# EAGLE design CAN_node_analog (EAGLE 8.0.1)
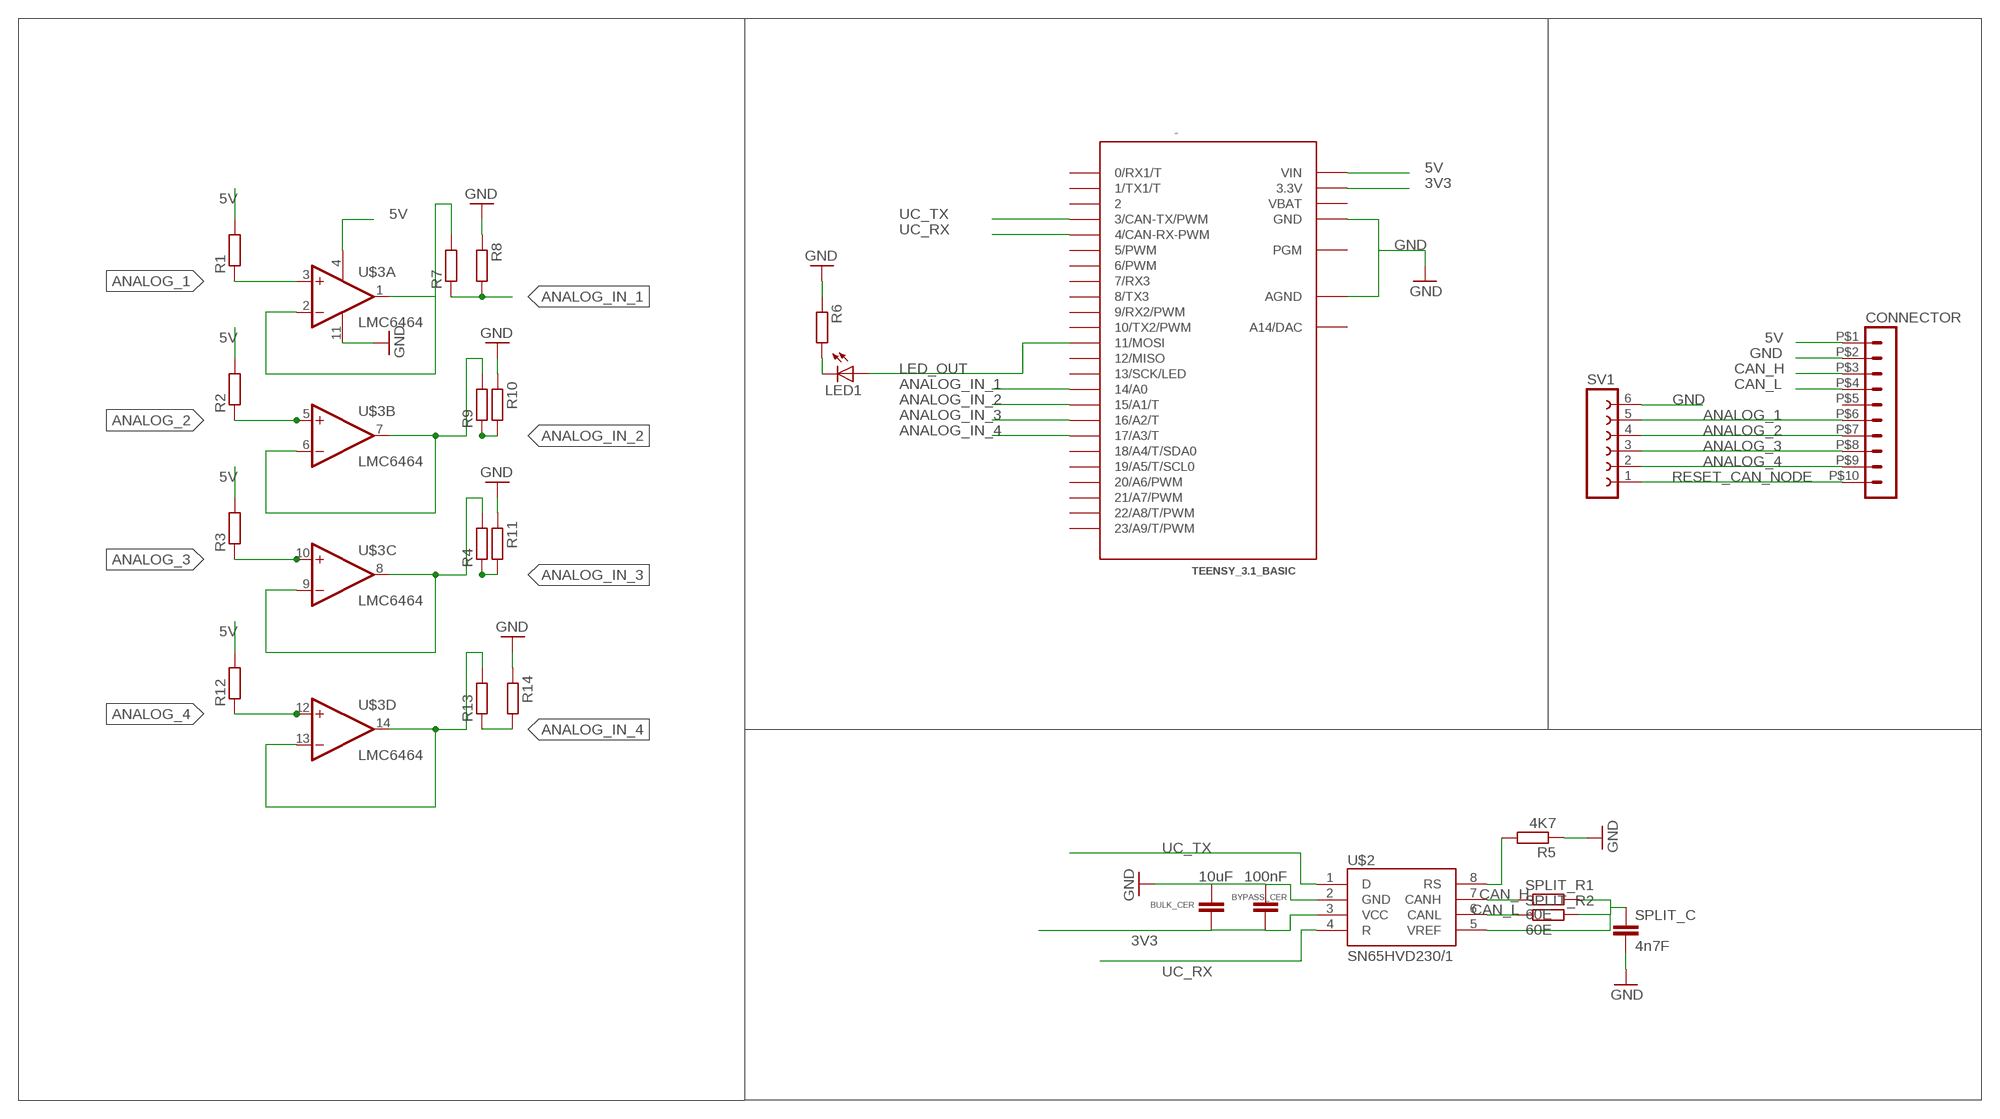
[diagram p0: schematic, sheet 1]

## Parts
BULK_CER  10uF  C-EUC0805  [C0805]
BYPASS_CER  100nF  C-EUC0805  [C0805]
CONNECTOR  HEADER_POS10_43045-1012  [43045-1012]
LED1  LED1206  [LED-1206]
R1  R-EU_R0805  [R0805]
R2  R-EU_R0805  [R0805]
R3  R-EU_R0805  [R0805]
R4  R-EU_R0805  [R0805]
R5  4K7  R-EU_R0805  [R0805]
R6  R-EU_R0805  [R0805]
R7  R-EU_R0805  [R0805]
R8  R-EU_R0805  [R0805]
R9  R-EU_R0805  [R0805]
R10  R-EU_R0805  [R0805]
R11  R-EU_R0805  [R0805]
R12  R-EU_R0805  [R0805]
R13  R-EU_R0805  [R0805]
R14  R-EU_R0805  [R0805]
SPLIT_C  4n7F  C-EUC0805  [C0805]
SPLIT_R1  60E  R-EU_R0805  [R0805]
SPLIT_R2  60E  R-EU_R0805  [R0805]
SV1  FE06-1  [FE06]
U$1  TEENSY_3.1_BASIC  [TEENSY_3.1_BASIC]
U$2  SN65HVD230/1  [SO8]
U$3  LMC6464  [SO14_LONGPADS]

## Nets
3V3: BULK_CER.1 BYPASS_CER.1 U$1.3.3V U$1.3.3V1(3.3V) U$2.3(VCC)
5V: CONNECTOR.P$1 R1.2 R2.2 R3.2 R12.2 U$1.VIN U$3.4(POW:V+)
.: R7.2 U$3.1(A:OUT) U$3.2(A:-IN)
.2: R9.2 U$3.6(B:-IN) U$3.7(B:OUT)
.3: R4.2 U$3.8(C:OUT) U$3.9(C:-IN)
.4: R13.2 U$3.13(D:-IN) U$3.14(D:OUT)
ANALOG_1: CONNECTOR.P$6 R1.1 SV1.5 U$3.3(A:+IN)
ANALOG_2: CONNECTOR.P$7 R2.1 SV1.4 U$3.5(B:+IN)
ANALOG_3: CONNECTOR.P$8 R3.1 SV1.3 U$3.10(C:+IN)
ANALOG_4: CONNECTOR.P$9 R12.1 SV1.2 U$3.12(D:+IN)
ANALOG_IN_1: R7.1 R8.2 U$1.14/A0
ANALOG_IN_2: R9.1 R10.2 U$1.15/A1(15/A1/T)
ANALOG_IN_3: R4.1 R11.2 U$1.16/A2(16/A2/T)
ANALOG_IN_4: R13.1 R14.2 U$1.17/A3(17/A3/T)
CAN_H: CONNECTOR.P$3 SPLIT_R1.1 U$2.7(CANH)
CAN_L: CONNECTOR.P$4 SPLIT_R2.1 U$2.6(CANL)
GND: BULK_CER.2 BYPASS_CER.2 CONNECTOR.P$2 R5.1 R6.1 R8.1 R10.1 R11.1 R14.1 SPLIT_C.2 SV1.6 U$1.AGND U$1.GND U$1.GND1(GND) U$2.2(GND) U$3.11(POW:V-)
LED_OUT: LED1.A U$1.11(11/MOSI)
N$1: LED1.C R6.2
N$5: R5.2 U$2.8(RS)
N$9: SPLIT_C.1 SPLIT_R1.2 SPLIT_R2.2 U$2.5(VREF)
RESET_CAN_NODE: CONNECTOR.P$10 SV1.1
UC_RX: U$1.4(4/CAN-RX-PWM) U$2.4(R)
UC_TX: U$1.3(3/CAN-TX/PWM) U$2.1(D)
Unconnected: CONNECTOR.P$5 U$1.0(0/RX1/T) U$1.1(1/TX1/T) U$1.2 U$1.5(5/PWM) U$1.6(6/PWM) U$1.7(7/RX3) U$1.8(8/TX3) U$1.9(9/RX2/PWM) U$1.10(10/TX2/PWM) U$1.12(12/MISO) U$1.13(13/SCK/LED) U$1.18/A4(18/A4/T/SDA0) U$1.19/A5(19/A5/T/SCL0) U$1.20/A6(20/A6/PWM) U$1.21/A7(21/A7/PWM) U$1.22/A8(22/A8/T/PWM) U$1.23/A9(23/A9/T/PWM) U$1.A14(A14/DAC) U$1.PGM

## Power pins joined to a net without a drawn wire
VBAT: U$1.VBAT

## Library data of the parts
BULK_CER BYPASS_CER SPLIT_C = LV:C-EU: CAPACITOR, European symbol
CONNECTOR = con-molex-micro-fit-3_0:HEADER_POS10_?: Molex - Micro-Fit 3.0 Series connector, 3.00mm (0.118") pitch header, 10 positions.
LED1 = IIT_BOMBAY_Racing:LED: LEDs Standard schematic elements and footprints for 5mm, 3mm, 1206, and 0603 sized LEDs. 5mm - Spark Fun Electronics SKU : COM-00529 (and others)
R1-R4 R6-R14 = IIT_BOMBAY_Racing:R-EU_: RESISTOR, European symbol
R5 SPLIT_R1 SPLIT_R2 = LV:R-EU_: RESISTOR, European symbol
SV1 = con-lsta:FE06-1: FEMALE HEADER; OC_FARNELL: unknown; OC_NEWARK: unknown
U$1 = IIT_BOMBAY_Racing:TEENSY_3.1_BASIC: Footprint for Teensy 3.1 board using all pin connections on the outer perimeter
U$2 = texas_1:SN65HVD230/1
U$3 = IIT_BOMBAY_Racing:LMC6464

## Net classes
0 default: width 0.127 mm, drill 0.127 mm, clearance 0.127 mm

## Board
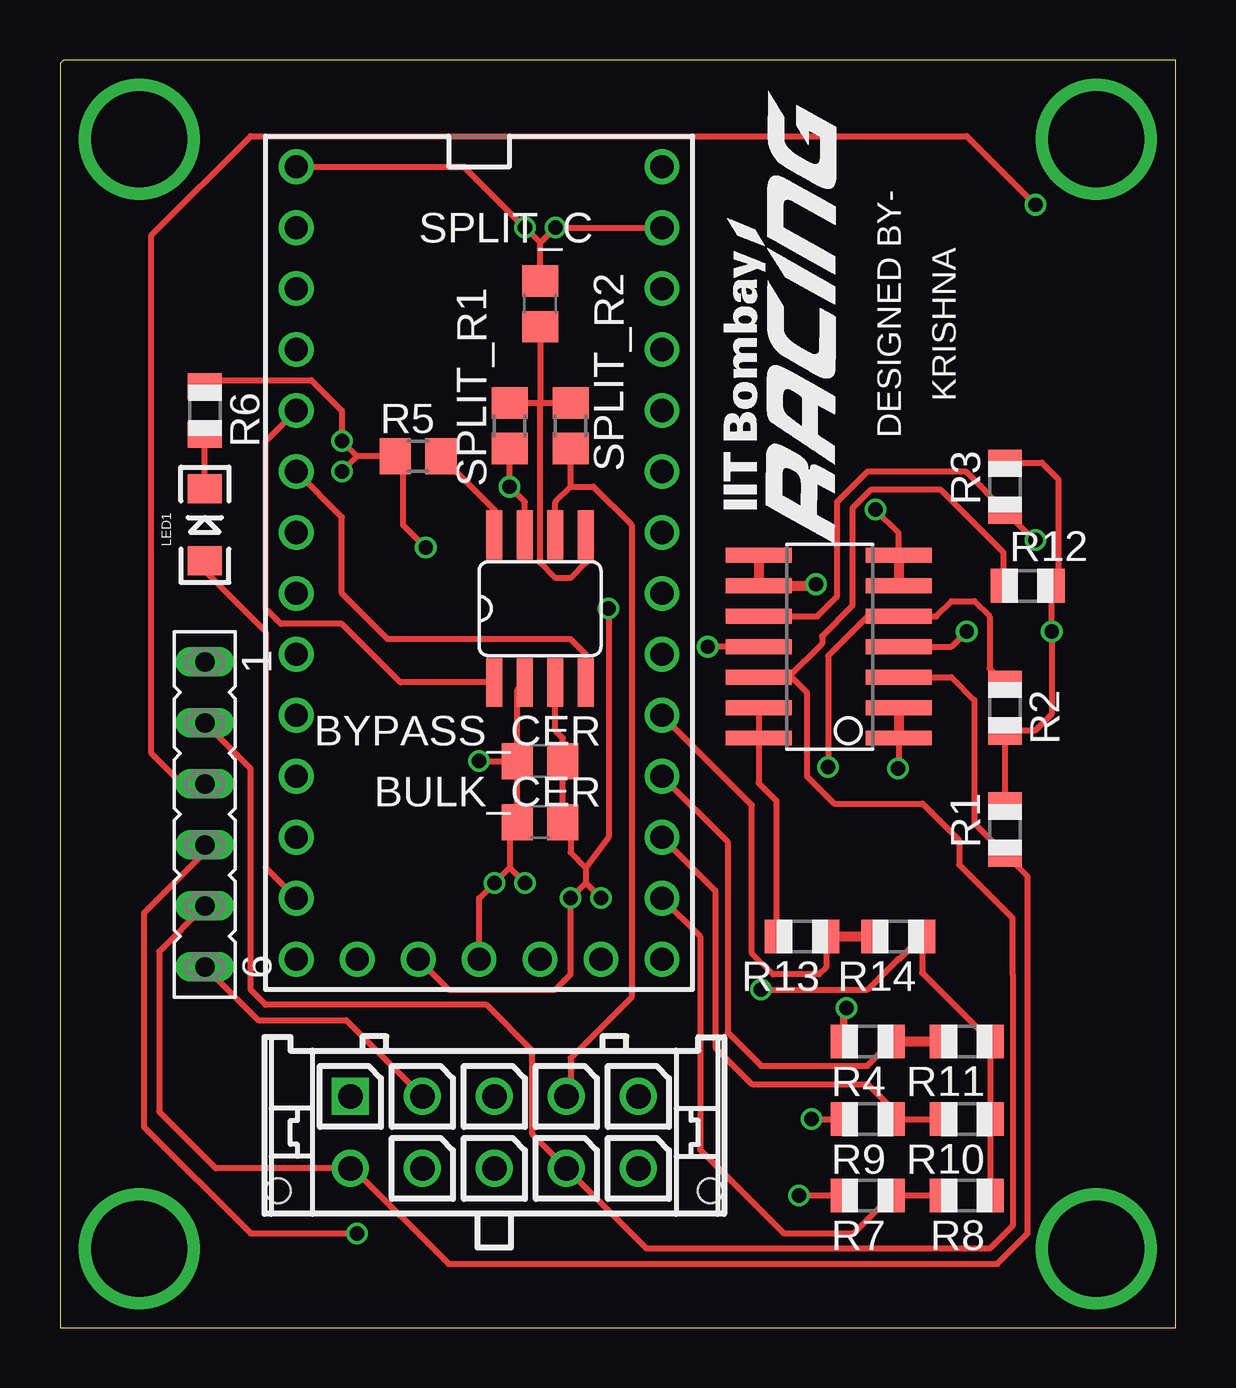
[diagram p1: board, top side]
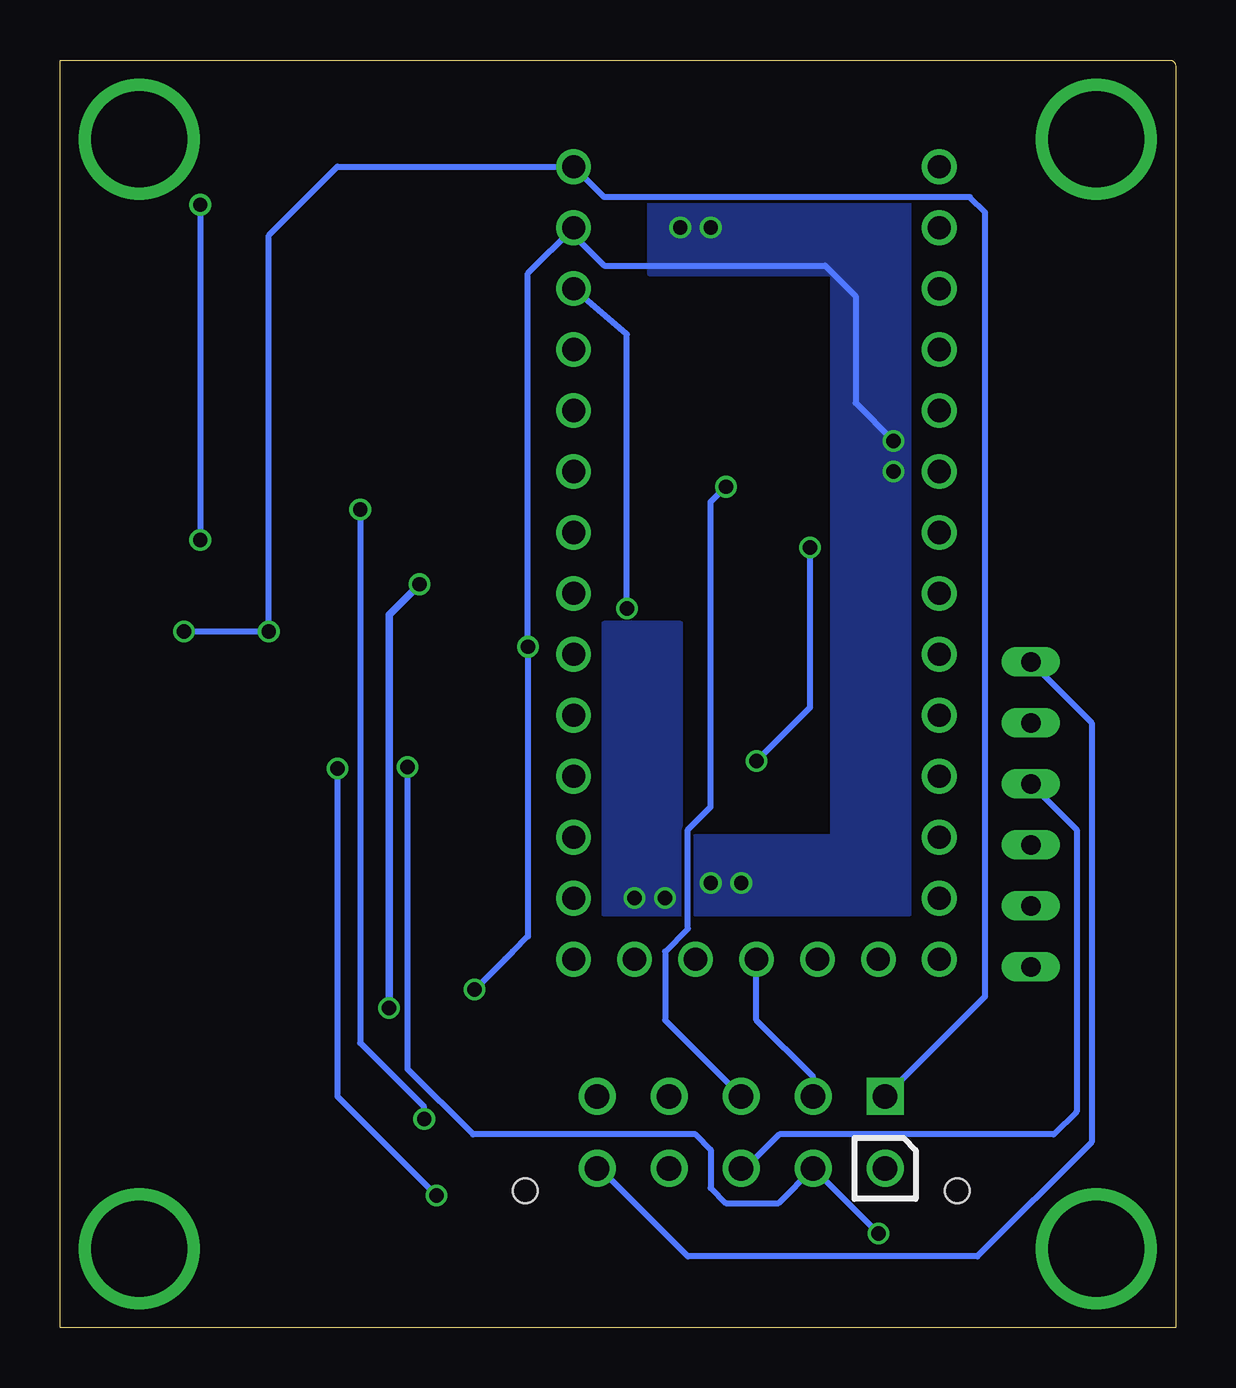
[diagram p2: board, bottom side, seen from below]

Size 46.48 x 52.83 mm. Coordinates in mm from the lower left corner, seen from the top.
Outline: 0,0 46.48,0 46.48,52.83 0.25,52.83 arc90 0,52.58 0,0
Copper layers (1*16): Top 0.035mm / dielectric 1.5mm / Bottom 0.035mm
Design rules "PCB_Power": minimum track width 5mil, minimum drill 10mil, track to track 5mil, track to pad 5mil, pad to pad 5mil, via to via 5mil, smd to smd 5mil, copper to edge 10mil, drill to drill 6mil, minimum pad ring 5mil, minimum via ring 5mil, stop-mask expansion 3mil, vias tented up to drill 0mil, thermal gap 10mil

### Footprints (pad centres in the part's own frame; a part is rotated, then mirrored left to right if it is on the bottom)
C0805 = smd 1.3 x 1.5: 1 -0.95,0; 2 0.95,0
43045-1012 = drill 1.02 square: P$1 6,0 | drill 1.02: P$2 3,0; P$3 0,0; P$4 -3,0; P$5 -6,0; P$6 6,3; P$7 3,3; P$8 0,3; P$9 -3,3; P$10 -6,3 | hole 1.02: 9,3.94; -9,3.94
LED-1206 = smd 1.2 x 1.4: A -1.5,0; C 1.5,0
R0805 = smd 1.1 x 1.4: 1 -1,0; 2 1,0
R0805' = smd 1.3 x 1.5: 1 -0.95,0; 2 0.95,0
FE06 = drill 0.813 long: 1 -6.35,0; 2 -3.81,0; 3 -1.27,0; 4 1.27,0; 5 3.81,0; 6 6.35,0
TEENSY_3.1_BASIC = drill 0.965: 0 -7.62,13.97; 1 -7.62,11.43; 2 -7.62,8.89; 3 -7.62,6.35; 3.3V 7.62,11.43; 3.3V1 -2.54,-16.51; 4 -7.62,3.81; 5 -7.62,1.27; 6 -7.62,-1.27; 7 -7.62,-3.81; 8 -7.62,-6.35; 9 -7.62,-8.89; 10 -7.62,-11.43; 11 -7.62,-13.97; 12 -7.62,-16.51; 13 7.62,-16.51; 14/A0 7.62,-13.97; 15/A1 7.62,-11.43; 16/A2 7.62,-8.89; 17/A3 7.62,-6.35; 18/A4 7.62,-3.81; 19/A5 7.62,-1.27; 20/A6 7.62,1.27; 21/A7 7.62,3.81; 22/A8 7.62,6.35; 23/A9 7.62,8.89; A14 5.08,-16.51; AGND 7.62,13.97; GND -7.62,16.51; GND1 0,-16.51; PGM 2.54,-16.51; VBAT -5.08,-16.51; VIN 7.62,16.51
SO8 = smd 0.66 x 2.032: 1 -1.905,-3.073; 2 -0.635,-3.073; 3 0.635,-3.073; 4 1.905,-3.073; 5 1.905,3.073; 6 0.635,3.073; 7 -0.635,3.073; 8 -1.905,3.073
SO14_LONGPADS = smd 0.61 x 2.762: 1 -6.35,-1.61; 2 -5.08,-1.61; 3 -3.81,-1.61; 4 -2.54,-1.61; 5 -1.27,-1.61; 6 0,-1.61; 7 1.27,-1.61; 8 1.27,4.226; 9 0,4.226; 10 -1.27,4.226; 11 -2.54,4.226; 12 -3.81,4.226; 13 -5.08,4.226; 14 -6.35,4.226

### Placement (x,y rotation side)
BULK_CER  20,21.08 180 top
BYPASS_CER  20,23.62 180 top
CONNECTOR  18.1,9.65 180 top
LED1  6.03,33.46 90 top
R1  39.37,20.76 90 top
R2  39.37,25.84 270 top
R3  39.37,35.05 90 top
R4  33.66,11.94 180 top
R5  4K7  [R0805']  14.92,36.32 0 top
R6  6.03,38.23 270 top
R7  33.66,5.52 180 top
R8  37.78,5.52 180 top
R9  33.66,8.7 180 top
R10  37.78,8.7 180 top
R11  37.78,11.94 180 top
R12  40.32,30.92 0 top
R13  30.92,16.32 180 top
R14  34.92,16.32 180 top
SPLIT_C  20,42.67 90 top
SPLIT_R1  60E  [R0805']  18.73,37.59 90 top
SPLIT_R2  60E  [R0805']  21.27,37.59 90 top
SV1  6.03,21.4 270 top
U$1  17.46,31.88 0 top
U$2  20,29.97 0 top
U$3  33.34,30.92 90 top
U$4  [IITBR_LOGO2]  32.77,31.94 90 top

### Tracks (layer width: path | path; a pad name or v marks a point on that pad's centre or on a via)
3V3  (via drill 0.6)
  Top 0.254: U$2.3 20.64,24.89 20.95,24.58 BYPASS_CER.1 BULK_CER.1 21.27,21.08 21.27,19.81 21.91,19.18 | 21.91,19.18 21.91,18.54 | 21.91,18.54 v21.27,17.91 21.27,14.73 20.64,14.1 16.19,14.1 U$1.3.3V1 | 21.91,18.54 v22.54,17.91 | v22.86,29.97 22.86,20.45 21.91,19.18
  Bottom 0.254: v22.86,29.97 22.86,41.4 U$1.3.3V
  pour Bottom: 20.64,17.27 20.64,29.34 23.81,29.34 23.81,17.27
5V  (via drill 0.6)
  Top 0.254: U$3.4 37.15,28.38 v37.78,29.02 | R3.2 40.91,36.05 41.59,35.37 41.59,31.2 R12.2 v41.32,29.02 41.32,25.57 40.64,24.89 39.42,24.89 R2.2 R1.2
  Bottom 0.254: CONNECTOR.P$1 7.94,13.81 7.94,46.48 8.57,47.12 23.81,47.12 U$1.VIN 34.92,48.39 37.78,45.53 v37.78,29.02 v41.32,29.02
.  (via drill 0.6)
  Top 0.254: U$3.1 34.95,23.33 v34.92,23.3 | v30.8,5.52 R7.2
  Top 0.406: U$3.2 U$3.1
  Bottom 0.254: v34.92,23.3 34.92,9.65 v30.8,5.52
.2  (via drill 0.6)
  Top 0.254: U$3.6 34.95,33.12 v33.97,34.1 | v31.3,8.7 R9.2
  Top 0.406: U$3.7 U$3.6
  Bottom 0.254: v33.97,34.1 33.97,11.87 31.3,9.21 v31.3,8.7
.3  (via drill 0.6)
  Top 0.305: v32.77,13.34 32.66,13.1 R4.2
  Top 0.406: U$3.8 U$3.9 31.43,30.92 arc90 v31.5,30.99
  Bottom 0.305: v31.5,30.99 32.77,29.72 v32.77,13.34
.4
  Top 0.254: U$3.13 U$3.14 29.11,22.7 29.84,21.97 29.84,16.4 R13.2
ANALOG_1
  Top 0.254: SV1.5 4.13,15.68 4.13,9.02 6.49,6.65 CONNECTOR.P$6 12.21,6.65 16.19,2.67 39.05,2.67 40.32,3.94 40.32,18.81 R1.1 38.1,21.04 38.1,26.16 37.15,27.11 U$3.3
ANALOG_2  (via drill 0.6)
  Top 0.254: SV1.4 6.03,19.81 3.49,17.27 3.49,8.38 7.94,3.94 v12.38,3.94 | R2.1 38.73,27.48 38.73,29.65 38.1,30.29 37.15,30.29 36.51,29.65 U$3.5 33.66,29.65 32.07,28.07 32,28 v32,23.37
  Bottom 0.254: v12.38,3.94 CONNECTOR.P$7 16.54,5.21 18.73,5.21 19.37,5.84 19.37,7.43 20,8.06 29.27,8.06 32,10.79 v32,23.37
ANALOG_3  (via drill 0.6)
  Top 0.254: U$3.10 30.48,29.65 31.56,29.65 32.38,30.48 32.38,34.42 33.66,35.69 37.73,35.69 R3.1 40.59,32.83 v40.64,32.83 | SV1.3 5.08,22.67 3.81,23.94 3.81,45.53 7.94,49.66 37.78,49.66 v40.64,46.8
  Bottom 0.254: SV1.3 4.13,20.77 4.13,9.02 5.08,8.06 16.51,8.06 17.92,6.65 CONNECTOR.P$8 | v40.64,46.8 v40.64,32.83
ANALOG_4
  Top 0.254: U$3.12 30.35,27.11 | 30.35,27.11 30.48,27.11 31.11,26.48 31.11,22.99 32.26,21.84 35.94,21.84 37.47,20.32 37.47,19.3 39.69,17.08 39.69,14.73 39.69,4.25 38.73,3.3 24.45,3.3 CONNECTOR.P$9 19.68,8.06 19.68,11.56 17.78,13.46 8.57,13.46 7.94,14.1 7.94,23.3 SV1.2 | R12.1 39.32,32.31 36.7,34.92 33.78,34.92 33.02,34.16 33.02,30.1 31.75,28.83 31.75,28.51 30.35,27.11
ANALOG_IN_1
  Top 0.254: R8.2 R7.1 33.07,3.94 30.16,3.94 26.67,7.43 26.67,16.32 U$1.14/A0
ANALOG_IN_2
  Top 0.254: R10.2 R9.1 34.66,9.16 33.66,10.16 28.83,10.16 27.3,11.68 27.3,18.22 U$1.15/A1
ANALOG_IN_3
  Top 0.254: U$1.16/A2 27.81,20.26 27.81,12.32 29.21,10.92 29.46,10.92 33.64,10.92 R4.1
  Top 0.406: R4.1 R11.2
ANALOG_IN_4
  Top 0.254: R13.1 31.92,15.03 31.62,14.73 29.72,14.73 28.83,15.62 28.83,21.78 U$1.17/A3
  Top 0.406: R13.1 R14.2
CAN_H  (via drill 0.6)
  Top 0.254: U$2.7 19.37,34.42 v18.73,35.05 SPLIT_R1.1
  Bottom 0.254: v18.73,35.05 19.37,34.42 19.37,21.72 20.32,20.77 20.32,16.64 21.27,15.68 21.27,12.83 CONNECTOR.P$3
CAN_L
  Top 0.254: 21.27,35.05 SPLIT_R2.1 | U$2.6 20.64,34.42 21.27,35.05 | 21.27,35.05 22.23,35.05 23.81,33.47 23.81,13.78 21.27,11.24 21.27,9.83 CONNECTOR.P$4
GND  (via drill 0.6)
  Top 0.254: BYPASS_CER.2 BULK_CER.2 18.73,21.08 18.73,19.18 | 12.38,36.32 R5.1 14.29,36.32 14.29,33.47 v15.24,32.51 | v11.75,35.69 12.38,36.32 | 12.38,36.32 v11.75,36.96 11.75,38.23 10.48,39.5 6.3,39.5 R6.1 | 18.73,19.18 v18.1,18.54 17.46,17.91 U$1.GND1 | 18.73,19.18 v19.37,18.54 | 20,45.21 SPLIT_C.2 20,43.31 | 20,45.21 v19.37,45.85 16.83,48.39 U$1.GND | 20,45.21 v20.64,45.85 U$1.AGND | BYPASS_CER.2 19.05,26.58 U$2.2 | SV1.6 8.26,12.83 11.92,12.83 CONNECTOR.P$2 | R8.1 R10.1 R11.1 35.92,14.8 R14.1 34.97,15.37 34.92,15.37 33.66,14.1 v29.21,14.1 | v17.46,23.62 BYPASS_CER.2 | U$3.11 v26.99,28.38
  Bottom 0.254: CONNECTOR.P$2 15.1,10.46 17.46,12.83 U$1.GND1 | v15.24,32.51 15.24,25.84 v17.46,23.62 | v29.21,14.1 27.94,15.37 27.62,15.68 26.99,16.32 v26.99,28.38 26.99,43.94 U$1.AGND 25.08,45.53 23.81,44.26 14.61,44.26 13.34,42.99 13.34,38.54 v11.75,36.96
  pour Bottom: 11.11,47.12 21.91,47.12 21.91,43.94 14.29,43.94 14.29,20.45 20,20.45 20,17.27 11.11,17.27
LED_OUT
  Top 0.254: LED1.A 6.03,31.56 8.57,29.02 8.57,19.18 U$1.11
N$1
  Top 0.254: LED1.C R6.2
N$2  (via drill 4.01)
  other vias: 3.3,3.3
N$3  (via drill 4.01)
  other vias: 3.3,49.53
N$4  (via drill 4.01)
  other vias: 43.18,3.3
N$5
  Top 0.254: U$2.8 18.1,34.1 R5.2
N$6  (via drill 4.01)
  other vias: 43.18,49.53
N$9
  Top 0.254: U$2.5 21.91,31.88 21.27,31.24 20.64,31.24 20,31.88 20,38.54 | SPLIT_R1.2 20,38.54 | 20,38.54 SPLIT_R2.2 | SPLIT_C.1 20,38.54
RESET_CAN_NODE
  Bottom 0.254: SV1.1 3.49,25.21 3.49,7.75 8.26,2.98 20.32,2.98 23.99,6.65 CONNECTOR.P$10
UC_RX
  Top 0.254: U$2.4 21.91,28.07 21.27,28.7 13.65,28.7 11.75,30.61 11.75,33.78 U$1.4
UC_TX
  Top 0.254: U$2.1 14.19,26.9 11.75,29.34 9.21,29.34 8.57,29.97 8.57,36.96 U$1.3

### Text on the board
tNames: KRISHNA | DESIGNED BY-